# Altium schematic sheet LMS7002M EEPROM.SchDoc
size A
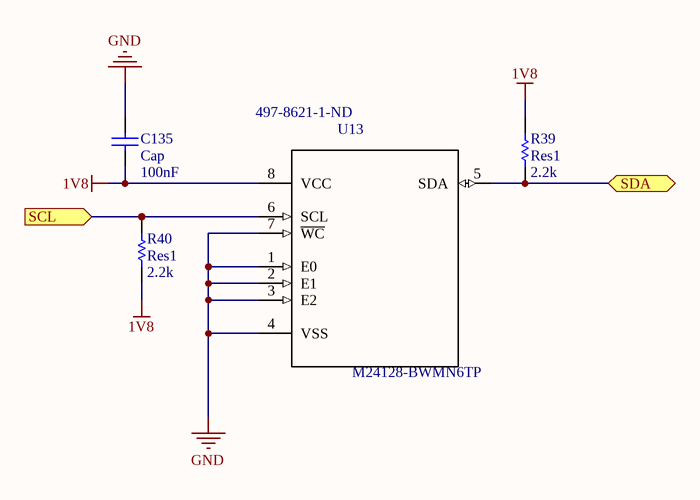
[diagram p0: LMS7002M EEPROM.SchDoc]

## Parts
C135  Cap  value 100nF  [0402-A]
R39  Res1  value 2.2k  [0402-A]
R40  Res1  value 2.2k  [0402-A]
U13  M24128-BWMN6TP  Supplier Part Number 1: 497-8621-1-ND  [*SOIC127P600X175-8N]

## Ports
SCL (in), SDA (bidir)

## Nets
1V8: C135.1 R39.2 R40.1 U13.8(VCC)
GND: C135.2 U13.1(E0) U13.2(E1) U13.3(E2) U13.4(VSS) U13.7(~{WC})
SCL: R40.2 U13.6(SCL) ; port SCL
SDA: R39.1 U13.5(SDA) ; port SDA

## Library data of the parts
C135 = Cap: Capacitor; Published: 8-Jun-2000; LatestRevisionDate: 17-Jul-2002; LatestRevisionNote: Re-released for DXP Platform.; PackageReference: RAD-0.3; Publisher: Altium Limited; PackageDescription: Radial Cap, Thru-Hole; 2 Leads; 0.3 in Pin Spacing
R39 R40 = Res1: Resistor; Published: 8-Jun-2000; LatestRevisionDate: 17-Jul-2002; LatestRevisionNote: Re-released for DXP Platform.; PackageReference: AXIAL-0.3; Publisher: Altium Limited; PackageDescription: Axial Device, Thru-Hole; 2 Leads; 0.3 in Pin Spacing
U13 = M24128-BWMN6TP: BuyPart: https://www.snapeda.com/parts/M24128-BWMN6TP/STMicroelectronics/view-part/1043181/?ref=eda; SnapEDA_Link: https://www.snapeda.com/parts/M24128-BWMN6TP/STMicroelectronics/view-part/1043181/?ref=snap; Value: *; Supplier 1: Digi-Key